# Altium project JacdacRp2040BrainEc30 124.PrjPCB (part 1 of 2)
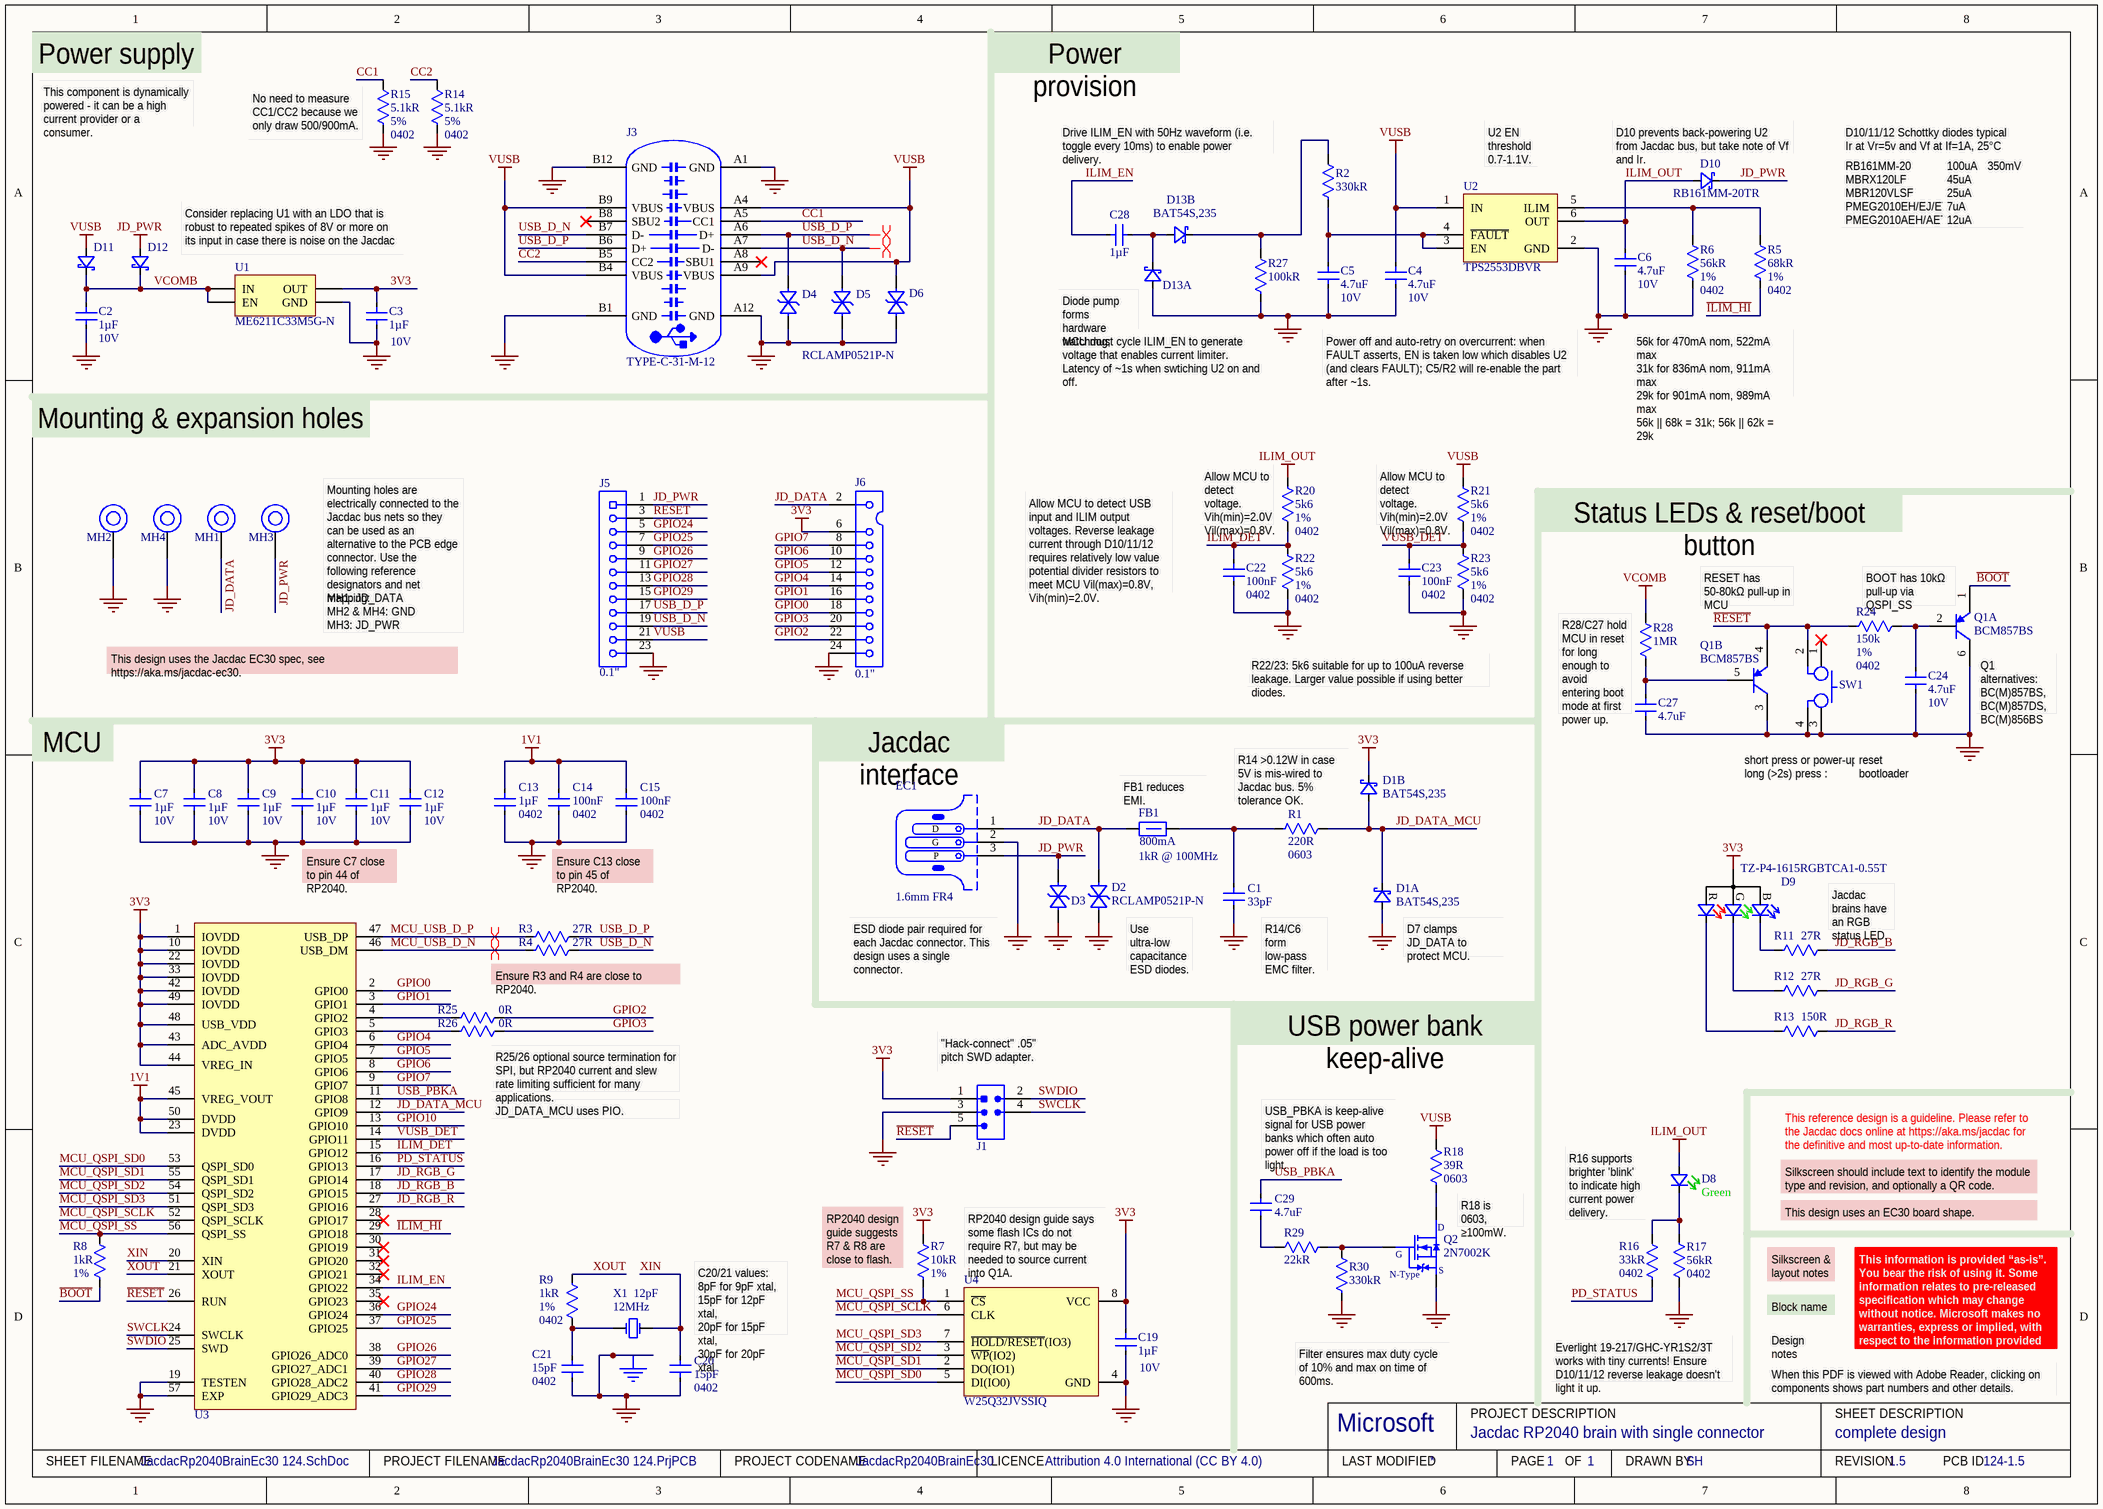
[diagram p0: JacdacRp2040BrainEc30 124.SchDoc]
ProjectCodeName: JacdacRp2040BrainEc30; ProjectCodenameDescription: Jacdac RP2040 brain with single connector; ProjectCodenameID: 124; ProjectDrawnBy: SH; ProjectLicenceTerms: Attribution 4.0 International (CC BY 4.0); ProjectRevision: 1.5
1 sheet, 82 parts. Net scope: global (net labels, ports and power ports of the same name join across sheets).
Board files: JacdacRp2040BrainEc30 124.PcbDoc, JacdacRp2040BrainEc30-NoStamp 124.PcbDoc

## Sheet JacdacRp2040BrainEc30 124.SchDoc: complete design
size A3; DrawnBy: SH; DocumentNumber: 1; Revision: 1.5; SheetNumber: 1; SheetTotal: 1; VersionControl_RevNumber: 1

### Parts
C1  Capacitance: 33pF  [C0402_0.55MM - without outline]  (hidden comment: CL05C330JB51PNC)
C2  Capacitance: 1µF  Voltage Rating: 10V  [C0402_0.55MM - without outline]  (hidden comment: CL05A105KP5NNNC)
C3  Capacitance: 1µF  Voltage Rating: 10V  [C0402_0.55MM - without outline]  (hidden comment: CL05A105KP5NNNC)
C4  Capacitance: 4.7uF  Voltage Rating: 10V  [C0402_0.55mm - without outline]  (hidden comment: CL05A475MP5NRNC)
C5  Capacitance: 4.7uF  Voltage Rating: 10V  [C0402_0.55mm - without outline]  (hidden comment: CL05A475MP5NRNC)
C6  Capacitance: 4.7uF  Voltage Rating: 10V  [C0402_0.55mm - without outline]  (hidden comment: CL05A475MP5NRNC)
C7  Capacitance: 1µF  Voltage Rating: 10V  [C0402_0.55MM - without outline]  (hidden comment: CL05A105KP5NNNC)
C8  Capacitance: 1µF  Voltage Rating: 10V  [C0402_0.55MM - without outline]  (hidden comment: CL05A105KP5NNNC)
C9  Capacitance: 1µF  Voltage Rating: 10V  [C0402_0.55MM - without outline]  (hidden comment: CL05A105KP5NNNC)
C10  Capacitance: 1µF  Voltage Rating: 10V  [C0402_0.55MM - without outline]  (hidden comment: CL05A105KP5NNNC)
C11  Capacitance: 1µF  Voltage Rating: 10V  [C0402_0.55MM - without outline]  (hidden comment: CL05A105KP5NNNC)
C12  Capacitance: 1µF  Voltage Rating: 10V  [C0402_0.55MM - without outline]  (hidden comment: CL05A105KP5NNNC)
C13  Case/Package: 0402  Capacitance: 1µF  [C0402_0.55MM - without outline]  (hidden comment: CL05A105KP5NNNC)
C14  Capacitance: 100nF  Case Code (Imperial): 0402  [C0402_0.55MM - without outline]  (hidden comment: CL05B104KP5NNNC)
C15  Capacitance: 100nF  Case Code (Imperial): 0402  [C0402_0.55MM - without outline]  (hidden comment: CL05B104KP5NNNC)
C19  Capacitance: 1µF  Voltage Rating: 10V  [C0402_0.55MM - without outline]  (hidden comment: CL05A105KP5NNNC)
C20  Capacitance: 15pF  Case/Package: 0402  [C0402_0.55MM - without outline]  (hidden comment: CL05C150JB5NNNC)
C21  Capacitance: 15pF  Case/Package: 0402  [C0402_0.55MM - without outline]  (hidden comment: CL05C150JB5NNNC)
C22  Capacitance: 100nF  Case Code (Imperial): 0402  [C0402_0.55MM - without outline]  (hidden comment: CL05B104KP5NNNC)
C23  Capacitance: 100nF  Case Code (Imperial): 0402  [C0402_0.55MM - without outline]  (hidden comment: CL05B104KP5NNNC)
C24  Capacitance: 4.7uF  Voltage Rating: 10V  [C0402_0.55mm - without outline]  (hidden comment: CL05A475MP5NRNC)
C27  Capacitance: 4.7uF  [C0402_0.55mm - without outline]  (hidden comment: CL05A475MP5NRNC)
C28  Capacitance: 1µF  [C0402_0.55MM - without outline]  (hidden comment: CL05A105KP5NNNC)
C29  Capacitance: 4.7uF  [C0402_0.55mm - without outline]  (hidden comment: CL05A475MP5NRNC)
D1  Manufacturer Part Number: BAT54S,235  [NXP-BAT54S-TO-236AB - without outline]  (hidden comment: BAT54S)  (parts A,B of 2)
D2  RCLAMP0521P-N  [TVS 0402 - L]
D3  RCLAMP0521P-N  [TVS 0402 - L]  (value not drawn)
D4  RCLAMP0521P-N  [TVS 0402 - L]  (value not drawn)
D5  RCLAMP0521P-N  [TVS 0402 - L]  (value not drawn)
D6  RCLAMP0521P-N  [TVS 0402 - L]
D8  Colour: Green  [0603 Green]
D9  TZ-P4-1615RGBTCA1-0.55T  [TZ-P4-1615RGBTCA1-0.55T]
D10  RB161MM-20TR  [SOD-123F - without outline]
D11  RB161MM-20TR  [SOD-123F - without outline]  (value not drawn)
D12  RB161MM-20TR  [SOD-123F - without outline]  (value not drawn)
D13  BAT54S  [NXP-BAT54S-TO-236AB - without outline]  (value not drawn)  (parts A,B of 2)
EC1  PCB Type: 1.6mm FR4  [JACDAC_EDGE_CONNECTOR_NO_TRACES_3D_PADS]  (hidden comment: Jacdac edge connector)  (no BOM)
FB1  Current Rating: 800mA  Impedance: 1kR @ 100MHz  [TDK MPZ1608 0.8mm - without outline]  (hidden comment: TDK MPZ1608S102ATA00)
J1  Hack Connect Mini 1.27 mm pitch 2-row  [HACK_CONNECT_MINI_5_X_1_27]  (value not drawn)  (no BOM)
J3  (no value)  [TYPE-C-31-M-12]
J5  0.1"  [Jacdac EC30 stamp holes 30mm bottom]  (no BOM)
J6  0.1"  [Jacdac EC30 stamp holes 30mm top]  (no BOM)
MH1  MH_7.0MMK_4.4MMC_3.1MMD_PTH  [MH_7.0MMK_4.4MMC_3.1MMD_PTH-SILK_D]  (value not drawn)  (no BOM)
MH2  MH_7.0MMK_4.4MMC_3.1MMD_PTH  [MH_7.0MMK_4.4MMC_3.1MMD_PTH-SILK_G]  (value not drawn)  (no BOM)
MH3  MH_7.0MMK_4.4MMC_3.1MMD_PTH  [MH_7.0MMK_4.4MMC_3.1MMD_PTH-SILK_P]  (value not drawn)  (no BOM)
MH4  MH_7.0MMK_4.4MMC_3.1MMD_PTH  [MH_7.0MMK_4.4MMC_3.1MMD_PTH-SILK_G]  (value not drawn)  (no BOM)
Q1  BCM857BS  [GENERIC-SOT363-NO-SILK]  (parts A,B of 2)
Q2  2N7002K  [SOT23-ONS]
R1  Resistance: 220R  Case/Package: 0603  [RC0603]
R2  Resistance: 330kR  [R0402 - without outline]  (hidden comment: RC0402FR-07330KL)
R3  Resistance: 27R  [R0402 - Without outline]  (hidden comment: RC0402FR-0727RL)
R4  Resistance: 27R  [R0402 - Without outline]  (hidden comment: RC0402FR-0727RL)
R5  Resistance: 68kR  Tolerance: 1%  Case/Package: 0402  [R0402 - Without outline]  (hidden comment: RC0402FR-0768KL)
R6  Resistance: 56kR  Tolerance: 1%  Case/Package: 0402  [R0402 - Without outline]  (hidden comment: RC0402FR-0756KL)
R7  Resistance: 10kR  Tolerance: 1%  [R0402 - Without outline]
R8  Resistance: 1kR  Tolerance: 1%  [R0402 - Without outline]  (hidden comment: RC0402FR-071KL)
R9  Resistance: 1kR  Tolerance: 1%  Case Code (Imperial): 0402  [R0402 - Without outline]  (hidden comment: RC0402FR-071KL)
R11  Resistance: 27R  [R0402 - Without outline]  (hidden comment: RC0402FR-0727RL)
R12  Resistance: 27R  [R0402 - Without outline]  (hidden comment: RC0402FR-0727RL)
R13  Resistance: 150R  [R0402 - Without outline]  (hidden comment: RC0402FR-07150RL)
R14  Resistance: 5.1kR  Tolerance: 5%  Case Code (Imperial): 0402  [R0402 - Without outline]  (hidden comment: RC0402JR-075K1L)
R15  Resistance: 5.1kR  Tolerance: 5%  Case Code (Imperial): 0402  [R0402 - Without outline]  (hidden comment: RC0402JR-075K1L)
R16  Resistance: 33kR  Case Code (Imperial): 0402  [R0402 - Without outline]  (hidden comment: RC0402FR-0733KL)
R17  Resistance: 56kR  Case/Package: 0402  [R0402 - Without outline]  (hidden comment: RC0402FR-0756KL)
R18  Resistance: 39R  Case Code (Imperial): 0603  [RC0603-M]  (hidden comment: RC0603FR-0739RL)
R20  Resistance: 5k6  Tolerance: 1%  Case Code (Imperial): 0402  [R0402 - Without outline]
R21  Resistance: 5k6  Tolerance: 1%  Case Code (Imperial): 0402  [R0402 - Without outline]
R22  Resistance: 5k6  Tolerance: 1%  Case Code (Imperial): 0402  [R0402 - Without outline]
R23  Resistance: 5k6  Tolerance: 1%  Case Code (Imperial): 0402  [R0402 - Without outline]
R24  Resistance: 150k  Tolerance: 1%  Case/Package: 0402  [R0402 - Without outline]  (hidden comment: RC0402FR-07150KL)
R25  Resistance: 0R  [R0402 - Without outline]  (hidden comment: RC0402JR-070RL)
R26  Resistance: 0R  [R0402 - Without outline]  (hidden comment: RC0402JR-070RL)
R27  Resistance: 100kR  [R0402 - Without outline]  (hidden comment: RC0402FR-07100KL)
R28  Resistance: 1MR  [R0402 - Without outline]  (hidden comment: RC0402FR-071ML)
R29  Resistance: 22kR  [R0402 - Without outline]  (hidden comment: RC0402FR-0722KL)
R30  Resistance: 330kR  [R0402 - without outline]  (hidden comment: RC0402FR-07330KL)
SW1  (no value)  [USAKRO-UK-B0267-SP25Y]
U1  (no value)  [MICRONE-SOT23-5]
U2  TPS2553DBVR  [TI-TPS2553 - without_outline]
U3  (no value)  [RP2040-SAFER-VIAS-0.15mm]
U4  (no value)  [8-SOIC]
X1  Frequency: 12MHz  Loading capacitance: 12pF  [generic xtal 3.2x2.5]  (hidden comment: generic SMD xtal 3.2x2.5mm)

### Nets
1V1: C13.2 C14.2 C15.2 U3.23(DVDD) U3.45(VREG_VOUT) U3.50(DVDD)
3V3: C3.2 C7.2 C8.2 C9.2 C10.2 C11.2 C12.2 C19.2 D1.2(K) D9.1(A) J1.1(VCC) J6.6 R7.1 U1.5(OUT) U3.1(IOVDD) U3.10(IOVDD) U3.22(IOVDD) U3.33(IOVDD) U3.42(IOVDD) U3.43(ADC_AVDD) U3.44(VREG_IN) U3.48(USB_VDD) U3.49(IOVDD) U4.8(VCC)
GND: C1.1 C2.1 C3.1 C4.1 C5.1 C6.1 C7.1 C8.1 C9.1 C10.1 C11.1 C12.1 C13.1 C14.1 C15.1 C19.1 C20.2 C21.2 C22.1 C23.1 C24.1 C27.1 D1.1(A) D2.2(A) D3.2(A) D4.2(A) D5.2(A) D6.2(A) D13.1(A) EC1.2(G) J1.3(GND) J3.A1(GND) J3.A12(GND) J3.B1(GND) J3.B12(GND) J5.23 J6.24 MH2.1 MH4.1 Q1.3(C2) Q1.6(C1) Q2.2(S) R6.1 R14.2 R15.2 R17.2 R22.1 R23.1 R27.1 R30.2 SW1.3 SW1.4 U1.2(GND) U2.2(GND) U3.19(TESTEN) U3.57(EXP) U4.4(GND) X1.2 X1.4
ILIM_OUT: C6.2 D8.2(A) D10.2(A) R20.2 U2.6(OUT)
JD_PWR: D3.1(K) D10.1(K) D12.2(A) EC1.3(P) J5.1 MH3.1
VCOMB: C2.2 D11.1(K) D12.1(K) R28.1 U1.1(IN) U1.3(EN)
VUSB: C4.2 D6.1(K) D11.2(A) J3.A4(VBUS) J3.A9(VBUS) J3.B4(VBUS) J3.B9(VBUS) J5.21 R18.2 R21.2 U2.1(IN)
~{BOOT}: Q1.1(E1) R8.2
CC1: J3.A5(CC1) R15.1
CC2: J3.B5(CC2) R14.1
GPIO0: J6.18 U3.2(GPIO0)
GPIO1: J6.16 U3.3(GPIO1)
GPIO2: J6.22 R25.2
GPIO3: J6.20 R26.2
GPIO4: J6.14 U3.6(GPIO4)
GPIO5: J6.12 U3.7(GPIO5)
GPIO6: J6.10 U3.8(GPIO6)
GPIO7: J6.8 U3.9(GPIO7)
GPIO10: U3.13(GPIO10)
GPIO24: J5.5 U3.36(GPIO24)
GPIO25: J5.7 U3.37(GPIO25)
GPIO26: J5.9 U3.38(GPIO26_ADC0)
GPIO27: J5.11 U3.39(GPIO27_ADC1)
GPIO28: J5.13 U3.40(GPIO28_ADC2)
GPIO29: J5.15 U3.41(GPIO29_ADC3)
~{ILIM_HI}: R5.1 U3.29(GPIO18)
ILIM_DET: C22.2 R20.1 R22.2 U3.15(GPIO12)
ILIM_EN: C28.2 U3.34(GPIO22)
JD_DATA: D2.1(K) EC1.1(D) FB1.1 J6.2 MH1.1
JD_DATA_MCU: D1.3(K) R1.2 U3.12(GPIO9)
JD_RGB_B: R11.2 U3.18(GPIO15)
JD_RGB_G: R12.2 U3.17(GPIO14)
JD_RGB_R: R13.2 U3.27(GPIO16)
MCU_QSPI_SCLK: U3.52(QSPI_SCLK) U4.6(CLK)
MCU_QSPI_SD0: U3.53(QSPI_SD0) U4.5(DI(IO0))
MCU_QSPI_SD1: U3.55(QSPI_SD1) U4.2(DO(IO1))
MCU_QSPI_SD2: U3.54(QSPI_SD2) U4.3(~{WP}(IO2))
MCU_QSPI_SD3: U3.51(QSPI_SD3) U4.7(~{HOLD/RESET}(IO3))
MCU_QSPI_SS: R7.2 R8.1 U3.56(QSPI_SS) U4.1(~{CS})
MCU_USB_D_N: R4.1 U3.46(USB_DM)
MCU_USB_D_P: R3.1 U3.47(USB_DP)
PD_STATUS: R16.1 U3.16(GPIO13)
~{RESET}: J1.5(RESET) J5.3 Q1.4(E2) R24.1 SW1.2 U3.26(RUN)
SWCLK: J1.4(SWCLK) U3.24(SWCLK)
SWDIO: J1.2(SWDIO) U3.25(SWD)
USB_D_N: D5.1(K) J3.A7(D-) J3.B7(D-) J5.19 R4.2
USB_D_P: D4.1(K) J3.A6(D+) J3.B6(D+) J5.17 R3.2
USB_PBKA: C29.1 U3.11(GPIO8)
VUSB_DET: C23.2 R21.1 R23.2 U3.14(GPIO11)
XIN: C20.1 U3.20(XIN) X1.3
XOUT: R9.2 U3.21(XOUT)
NetC1_2: C1.2 FB1.2 R1.1
NetC5_2: C5.2 R2.2 U2.3(EN) U2.4(~{FAULT})
NetC21_1: C21.1 R9.1 X1.1
NetC24_2: C24.2 Q1.2(B1) R24.2
NetC27_2: C27.2 Q1.5(B2) R28.2
NetC28_1: C28.1 D13.3(A)
NetC29_2: C29.2 R29.2
NetD8_1: D8.1(K) R16.2 R17.1
NetD9_2: D9.2(R) R13.1
NetD9_3: D9.3(G) R12.1
NetD9_4: D9.4(B) R11.1
NetD13_2: D13.2(K) R2.1 R27.2
NetQ2_1: Q2.1(G) R29.1 R30.1
NetQ2_3: Q2.3(D) R18.1
NetR5_2: R5.2 R6.2 U2.5(ILIM)
NetR25_1: R25.1 U3.4(GPIO2)
NetR26_1: R26.1 U3.5(GPIO3)

Not connected (* = marked no-connect by the designer): J3 A8(SBU1)* B8(SBU2)*; SW1 1*; U3 28(GPIO17)* 30(GPIO19)* 31(GPIO20)* 32(GPIO21)* 35(GPIO23)*

### Layout directives
differential pair: MCU_USB_D_N, MCU_USB_D_P, USB_D_N, USB_D_P

### Notes on the sheet
- Power supply
- Power provision
- This component is dynamically powered - it can be a high current provider or a consumer.
- (near R15) No need to measure CC1/CC2 because we only draw 500/900mA.
- Drive ILIM_EN with 50Hz waveform (i.e. toggle every 10ms) to enable power delivery.
- (near U2) U2 EN threshold 0.7-1.1V.
- (near D10) D10 prevents back-powering U2 from Jacdac bus, but take note of Vf and Ir.
- D10/11/12 Schottky diodes typical
  Ir at Vr=5v and Vf at If=1A, 25°C
- RB161MM-20
  MBRX120LF
  MBR120VLSF
  PMEG2010EH/EJ/ET
  PMEG2010AEH/AET
- 100uA
  45uA
  25uA
  7uA
  12uA
- 350mV
- Consider replacing U1 with an LDO that is robust to repeated spikes of 8V or more on its input in case there is noise on the Jacdac bus.
- MCU must cycle ILIM_EN to generate voltage that enables current limiter. Latency of ~1s when swtiching U2 on and off.
- (near D13) Diode pump forms hardware watchdog;
- Power off and auto-retry on overcurrent: when FAULT asserts, EN is taken low which disables U2 (and clears FAULT); C5/R2 will re-enable the part after ~1s.
- Mounting & expansion holes
- 56k for 470mA nom, 522mA max
  31k for 836mA nom, 911mA max
  29k for 901mA nom, 989mA max
  56k || 68k = 31k; 56k || 62k = 29k
- (near MH3) Mounting holes are electrically connected to the Jacdac bus nets so they can be used as an alternative to the PCB edge connector. Use the following reference designators and net mapping:
- Allow MCU to detect USB input and ILIM output voltages. Reverse leakage current through D10/11/12 requires relatively low value potential divider resistors to meet MCU Vil(max)=0.8V, Vih(min)=2.0V.
- (near R20) Allow MCU to detect voltage. Vih(min)=2.0V
  Vil(max)=0.8V.
- (near R21) Allow MCU to detect voltage. Vih(min)=2.0V
  Vil(max)=0.8V.
- Status LEDs & reset/boot button
- MH1: JD_DATA
  MH2 & MH4: GND
  MH3: JD_PWR
- RESET has 50-80kΩ pull-up in MCU
- (near Q1) BOOT has 10kΩ pull-up via QSPI_SS
- This design uses the Jacdac EC30 spec, see https://aka.ms/jacdac-ec30.
- R22/23: 5k6 suitable for up to 100uA reverse leakage. Larger value possible if using better diodes.
- R28/C27 hold MCU in reset for long enough to avoid entering boot mode at first power up.
- (near Q1) Q1 alternatives:
  BC(M)857BS, BC(M)857DS, BC(M)856BS
- (near C7) MCU
- Jacdac interface
- short press or power-up:
  long (>2s) press :
- reset
  bootloader
- (near FB1) FB1 reduces EMI.
- R14 >0.12W in case 5V is mis-wired to Jacdac bus. 5% tolerance OK.
- Ensure C7 close to pin 44 of RP2040.
- Ensure C13 close to pin 45 of RP2040.
- (near R4) Ensure R3 and R4 are close to RP2040.
- ESD diode pair required for each Jacdac connector. This design uses a single connector.
- Use ultra-low capacitance ESD diodes.
- (near C1) R14/C6 form low-pass EMC filter.
- (near D1) D7 clamps JD_DATA to protect MCU.
- (near R11) Jacdac brains have an RGB status LED.
- USB power bank keep-alive
- JD_DATA_MCU uses PIO.
- (near R26) R25/26 optional source termination for SPI, but RP2040 current and slew rate limiting sufficient for many applications.
- (near J1) "Hack-connect" .05" pitch SWD adapter.
- USB_PBKA is keep-alive signal for USB power banks which often auto power off if the load is too light.
- Silkscreen should include text to identify the module type and revision, and optionally a QR code.
- This reference design is a guideline. Please refer to the Jacdac docs online at https://aka.ms/jacdac for the definitive and most up-to-date information.
- (near R7) RP2040 design guide suggests R7 & R8 are close to flash.
- RP2040 design guide says some flash ICs do not require R7, but may be needed to source current into Q1A.
- R18 is 0603, ≥100mW.
- R16 supports brighter 'blink' to indicate high current power delivery.
- This design uses an EC30 board shape.
- Block name
- Silkscreen & layout notes
- (near C20) C20/21 values:
  8pF for 9pF xtal,
  15pF for 12pF xtal,
  20pF for 15pF xtal,
  30pF for 20pF xtal
- Filter ensures max duty cycle of 10% and max on time of 600ms.
- Everlight 19-217/GHC-YR1S2/3T works with tiny currents! Ensure D10/11/12 reverse leakage doesn't light it up.
- Design notes
- When this PDF is viewed with Adobe Reader, clicking on components shows part numbers and other details.
- This information is provided “as-is”. You bear the risk of using it. Some information relates to pre-released specification which may change without notice. Microsoft makes no warranties, express or implied, with respect to the information provided here.
- Microsoft
- PROJECT DESCRIPTION
- SHEET DESCRIPTION
- SHEET FILENAME
- PROJECT FILENAME
- PROJECT CODENAME
- LICENCE
- LAST MODIFIED
- PAGE
- OF
- DRAWN BY
- REVISION
- PCB ID
- (in symbol 2N7002K) N-Type